# Altium schematic sheet MULTIB.SchDoc
size A3
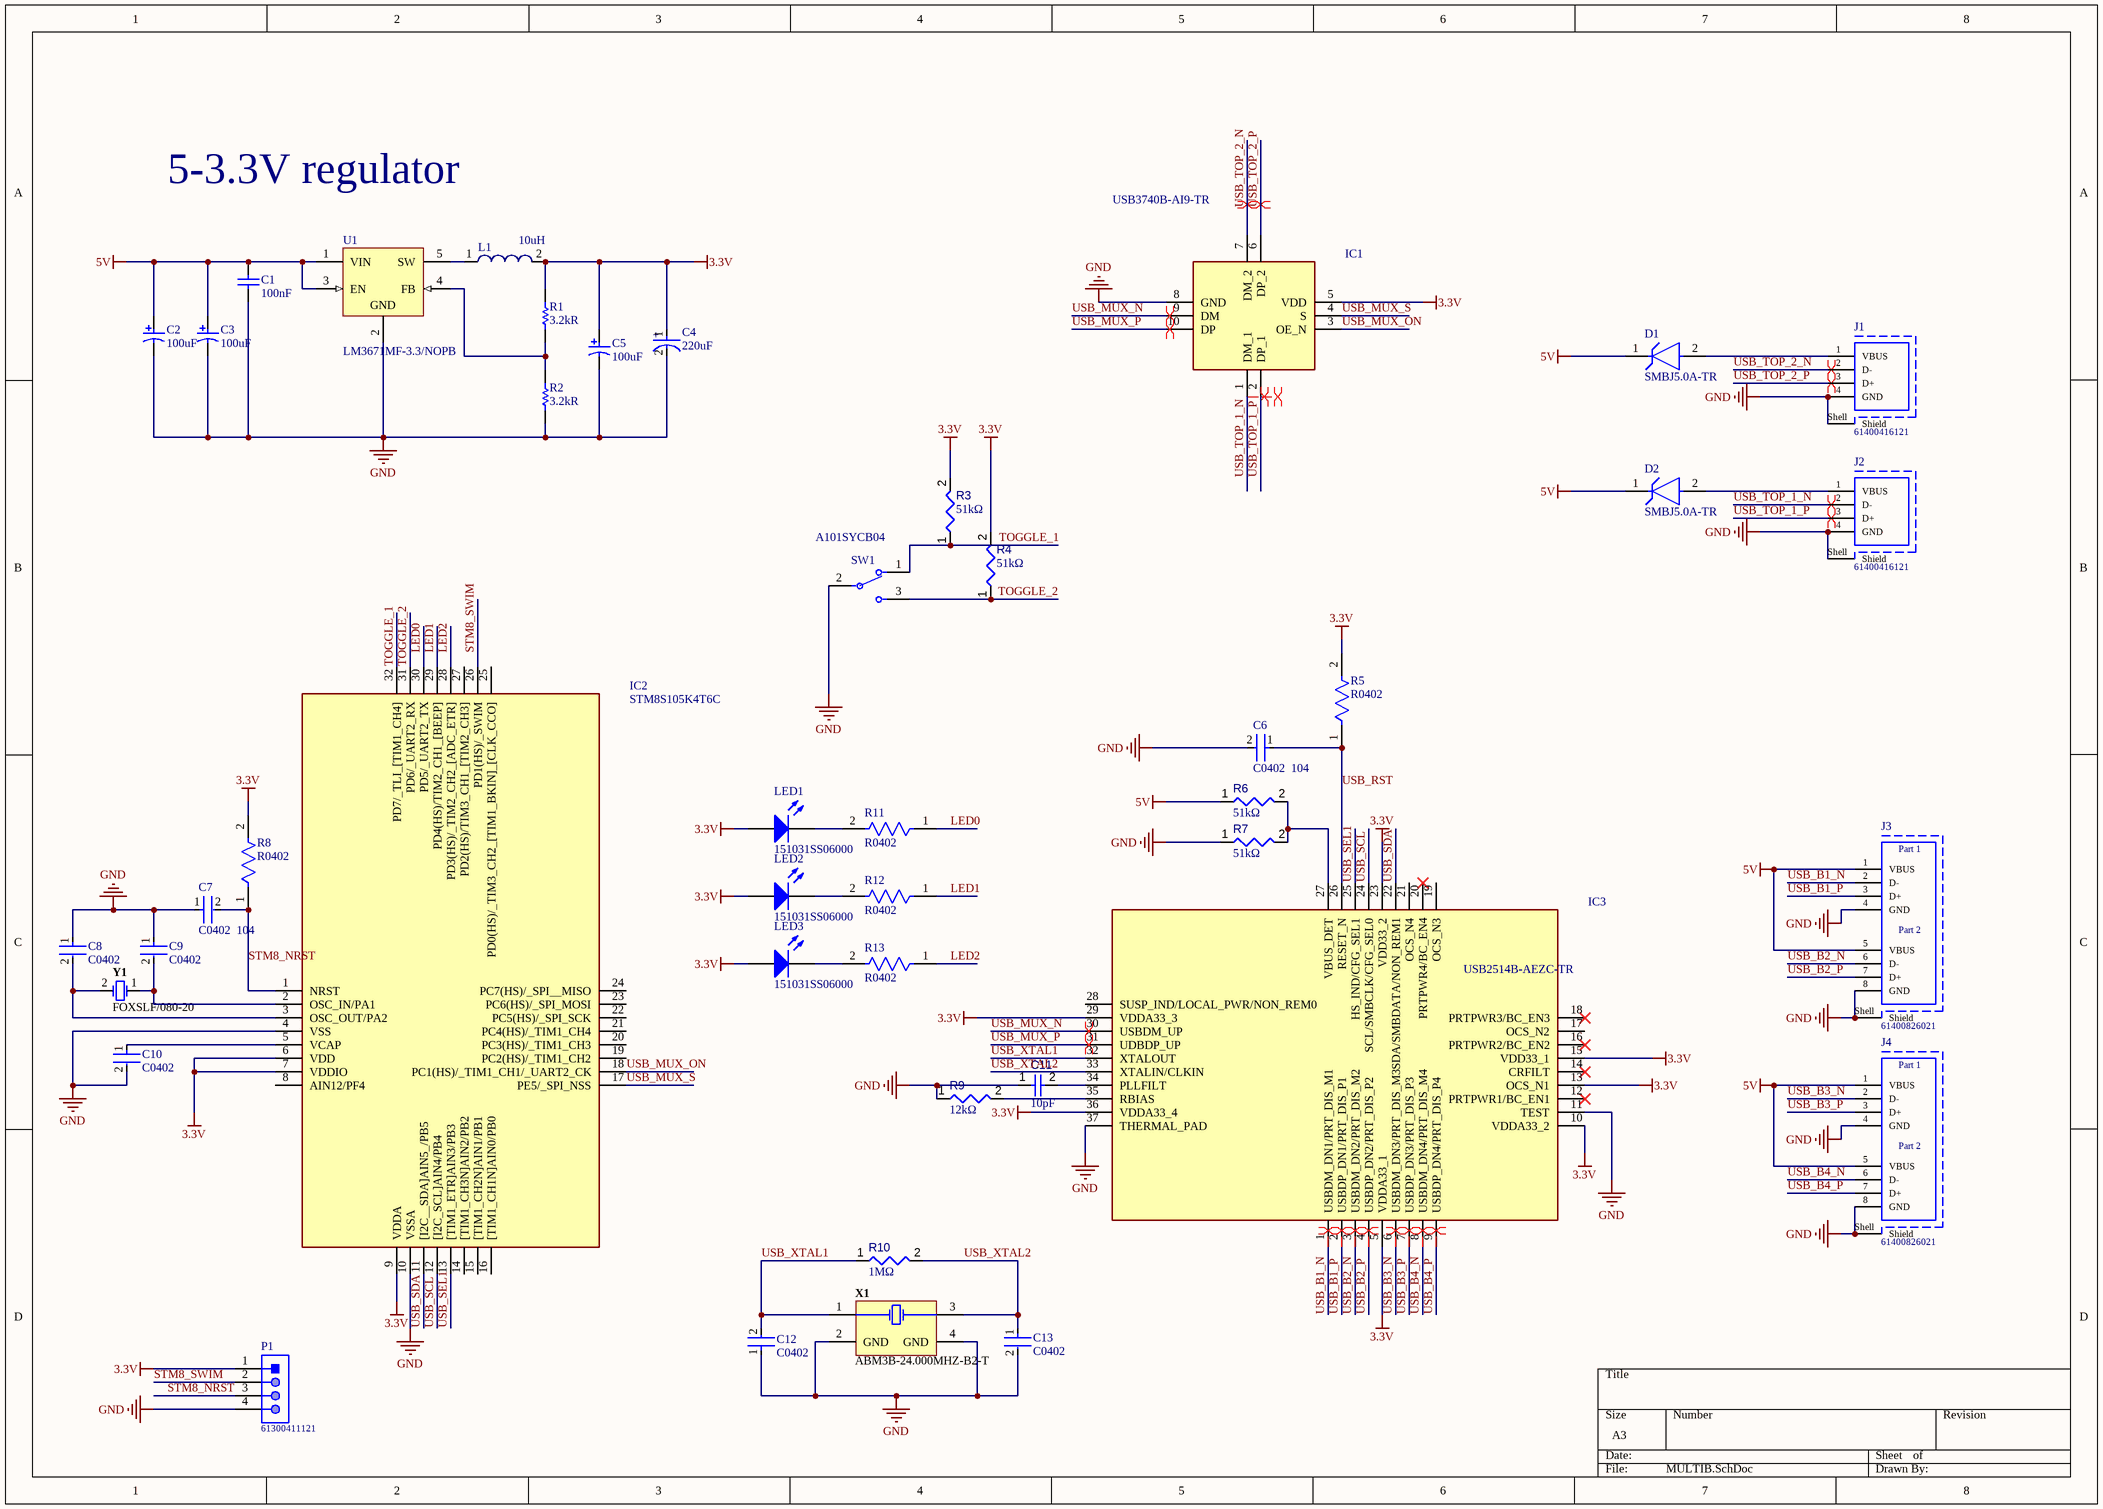
[diagram p0: MULTIB.SchDoc]

## Parts
C1  100nF  [CAPC1608X90X35ML10T15]
C2  100uF  [CAPPR65-350-1150X800X1250]
C3  100uF  [CAPPR65-350-1150X800X1250]
C4  220uF  [FP-EEU-FC1V221L-MFG]
C5  100uF  [CAPPR65-350-1150X800X1250]
C6  C0402  104  [FP-C0402-BB-MFG]
C7  C0402  104  [FP-C0402-BB-MFG]
C8  C0402  [FP-C0402-BB-MFG]
C9  C0402  [FP-C0402-BB-MFG]
C10  C0402  [FP-C0402-BB-MFG]
C11  value 10pF  [CAPC1608X90X40ML10T20]  (hidden comment: Capacitor 10 pF +/- 5% 50 V 0603)
C12  C0402  [FP-C0402-BB-MFG]
C13  C0402  [FP-C0402-BB-MFG]
D1  SMBJ5.0A-TR  [FP-SMB-MFG]
D2  SMBJ5.0A-TR  [FP-SMB-MFG]
IC1  USB3740B-AI9-TR  [USB3740BAI9TR]
IC2  STM8S105K4T6C  [QFP80P900X900X160-32N]
IC3  USB2514B-AEZC-TR  [QFN50P600X600X100-37N-D]
J1  61400416121  [61400416121]
J2  61400416121  [61400416121]
J3  61400826021  [61400826021]
J4  61400826021  [61400826021]
L1  10uH  [WE-SPC 4838]
LED1  151031SS06000  [Type 3mm]
LED2  151031SS06000  [Type 3mm]
LED3  151031SS06000  [Type 3mm]
P1  61300411121  [61300411121]
R1  3.2kR  [RESC1005X40X25LL05T05]
R2  3.2kR  [RESC1005X40X25LL05T05]
R3  value 51kΩ  [RESC0603(1608)_L]  (hidden comment: 120R3J)
R4  value 51kΩ  [RESC0603(1608)_L]  (hidden comment: 120R3J)
R5  R0402  [FP-CRCW0402-e3-IPC_C]
R6  value 51kΩ  [RESC0603(1608)_L]  (hidden comment: 120R3J)
R7  value 51kΩ  [RESC0603(1608)_L]  (hidden comment: 120R3J)
R8  R0402  [FP-CRCW0402-e3-IPC_C]
R9  value 12kΩ  [RESC0603(1608)_L]  (hidden comment: 120R3J)
R10  value 1MΩ  [RESC0603(1608)_L]  (hidden comment: 120R3J)
R11  R0402  [FP-CRCW0402-e3-IPC_C]
R12  R0402  [FP-CRCW0402-e3-IPC_C]
R13  R0402  [FP-CRCW0402-e3-IPC_C]
SW1  A101SYCB04  [FP-A101SYCB04-MFG]
U1  LM3671MF-3.3/NOPB  [DBV0005A_N]
X1  ABM3B-24.000MHZ-B2-T  [ABRA-ABM3B-4_V]
Y1  FOXSLF/080-20  [FOX-FOXSLF080-20]

## Nets
3.3V: C4.1(C) C5.1 IC1.5(VDD) IC2.6(VDD) IC2.7(VDDIO) IC2.9(VDDA) IC3.5(VDDA33_1) IC3.10(VDDA33_2) IC3.13(OCS_N1) IC3.15(VDD33_1) IC3.23(VDD33_2) IC3.29(VDDA33_3) IC3.36(VDDA33_4) L1.2 LED1.2(A) LED2.2(A) LED3.2(A) P1.1 R1.2 R3.2 R4.2 R5.2 R8.2
5V: C1.2 C2.1 C3.1 D1.1(K) D2.1(K) J3.1(VBUS) J3.5(VBUS) J4.1(VBUS) J4.5(VBUS) R6.1 U1.1(VIN) U1.3(EN)
GND: C1.1 C2.2 C3.2 C4.2(A) C5.2 C6.2 C7.1 C8.1 C9.1 C10.2 C11.1 C12.1 C13.2 IC1.8(GND) IC2.4(VSS) IC2.10(VSSA) IC3.11(TEST) IC3.37(THERMAL_PAD) J1.4(GND) J1.Shell(Shield) J2.4(GND) J2.Shell(Shield) J3.4(GND) J3.8(GND) J3.Shell(Shield) J4.4(GND) J4.8(GND) J4.Shell(Shield) P1.4 R2.1 R7.1 R9.1 SW1.2 U1.2(GND) X1.2(GND) X1.4(GND)
LED0: IC2.30(PD5/_UART2_TX) R11.1
LED1: IC2.29(PD4(HS)/TIM2_CH1_[BEEP]) R12.1
LED2: IC2.28(PD3(HS)/_TIM2_CH2_[ADC_ETR]) R13.1
STM8_NRST: C7.2 IC2.1(NRST) P1.3 R8.1
STM8_SWIM: IC2.26(PD1(HS)/_SWIM) P1.2
TOGGLE_1: IC2.32(PD7/_TLI_[TIM1_CH4]) R3.1 SW1.1
TOGGLE_2: IC2.31(PD6/_UART2_RX) R4.1 SW1.3
USB_B1_N: IC3.1(USBDM_DN1/PRT_DIS_M1) J3.2(D-)
USB_B1_P: IC3.2(USBDP_DN1/PRT_DIS_P1) J3.3(D+)
USB_B2_N: IC3.3(USBDM_DN2/PRT_DIS_M2) J3.6(D-)
USB_B2_P: IC3.4(USBDP_DN2/PRT_DIS_P2) J3.7(D+)
USB_B3_N: IC3.6(USBDM_DN3/PRT_DIS_M3) J4.2(D-)
USB_B3_P: IC3.7(USBDP_DN3/PRT_DIS_P3) J4.3(D+)
USB_B4_N: IC3.8(USBDM_DN4/PRT_DIS_M4) J4.6(D-)
USB_B4_P: IC3.9(USBDP_DN4/PRT_DIS_P4) J4.7(D+)
USB_MUX_N: IC1.9(DM) IC3.30(USBDM_UP)
USB_MUX_ON: IC1.3(OE_N) IC2.18(PC1(HS)/_TIM1_CH1/_UART2_CK)
USB_MUX_P: IC1.10(DP) IC3.31(UDBDP_UP)
USB_MUX_S: IC1.4(S) IC2.17(PE5/_SPI_NSS)
USB_RST: C6.1 IC3.26(RESET_N) R5.1
USB_SCL: IC2.12([I2C_SCL]AIN4/PB4) IC3.24(SCL/SMBCLK/CFG_SEL0)
USB_SDA: IC2.11([I2C__SDA]AIN5_/PB5) IC3.22(SDA/SMBDATA/NON_REM1)
USB_SEL1: IC2.13([TIM1_ETR]AIN3/PB3) IC3.25(HS_IND/CFG_SEL1)
USB_TOP_1_N: IC1.1(DM_1) J2.2(D-)
USB_TOP_1_P: IC1.2(DP_1) J2.3(D+)
USB_TOP_2_N: IC1.7(DM_2) J1.2(D-)
USB_TOP_2_P: IC1.6(DP_2) J1.3(D+)
USB_XTAL1: C12.2 IC3.32(XTALOUT) R10.1 X1.1(X1)
USB_XTAL2: C13.1 IC3.33(XTALIN/CLKIN) R10.2 X1.3(X2)
NetC8_2: C8.2 IC2.3(OSC_OUT/PA2) Y1.2
NetC9_2: C9.2 IC2.2(OSC_IN/PA1) Y1.1
NetC10_1: C10.1 IC2.5(VCAP)
NetC11_2: C11.2 IC3.34(PLLFILT)
NetD1_2: D1.2(A) J1.1(VBUS)
NetD2_2: D2.2(A) J2.1(VBUS)
NetIC3_27: IC3.27(VBUS_DET) R6.2 R7.2
NetIC3_35: IC3.35(RBIAS) R9.2
NetL1_1: L1.1 U1.5(SW)
NetLED1_1: LED1.1(K) R11.2
NetLED2_1: LED2.1(K) R12.2
NetLED3_1: LED3.1(K) R13.2
NetR1_1: R1.1 R2.2 U1.4(FB)

Not connected (* = marked no-connect by the designer): IC2 8(AIN12/PF4) 14([TIM1_CH3N]AIN2/PB2) 15([TIM1_CH2N]AIN1/PB1) 16([TIM1_CH1N]AIN0/PB0) 19(PC2(HS)/_TIM1_CH2) 20(PC3(HS)/_TIM1_CH3) 21(PC4(HS)/_TIM1_CH4) 22(PC5(HS)/_SPI_SCK) 23(PC6(HS)/_SPI_MOSI) 24(PC7(HS)/_SPI__MISO) 25(PD0(HS)/_TIM3_CH2_[TIM1_BKIN]_[CLK_CCO]) 27(PD2(HS)/TIM3_CH1_[TIM2_CH3]); IC3 12(PRTPWR1/BC_EN1)* 14(CRFILT)* 16(PRTPWR2/BC_EN2)* 17(OCS_N2) 18(PRTPWR3/BC_EN3)* 19(OCS_N3) 20(PRTPWR4/BC_EN4)* 21(OCS_N4) 28(SUSP_IND/LOCAL_PWR/NON_REM0)

## Layout directives
differential pair: USB_B1_N, USB_B1_P, USB_B2_N, USB_B2_P, USB_B3_N, USB_B3_P, USB_B4_N, USB_B4_P, USB_MUX_N, USB_MUX_P, USB_TOP_1_N, USB_TOP_1_P, USB_TOP_2_N, USB_TOP_2_P

## Notes on the sheet
- 5-3.3V regulator
- (in symbol CMP-1502-03229-1) Part 1; Part 2
- (in symbol CMP-05427-000010-1) +

## Library data of the parts
C1 = CMP-2000-04945-1: Chip Capacitor, 22 pF, +/- 5%, 50 V, -55 to 125 degC, 0603 (1608 Metric), RoHS, Tape and Reel; Manufacturer: Murata; Capacitance: 22pF; Rated Voltage: 50V; Dielectric: C0G; Manufacturer URL: http://www.murata.com/; Datasheet Version: Jul-06; Package Reference: 603; Tolerance (%): ±5%; Case Size/Dimension: 0603; Package Description: 2-Pin Surface Mount Device, Body 1.6 x 0.8 mm; Datasheet URL: https://datasheet.ciiva.com/11786/0900766b807a1cab-11786398.pdf
C2 C3 C5 = CMP-1665-00042-2: Aluminum Electrolytic Capacitor, 100 uF, +/- 20%, 50 V, -40 to 85 degC, 2-Pin THD, RoHS, Bulk; Manufacturer: Panasonic; Lead Diameter: 0.6mm; Dielectric Material: Aluminium; Voltage Rating (DC): 50V; Ripple Current (AC): 250mA; Polarity: Polar; Leakage Current: 3uA; Life (Hours): 2000Hour; Lead/Base Style: Straight; Dissipation Factor: 0.12%; Radiation Hardening: No; Height: 11.5mm; Package Quantity: 200; Package Reference: CAPPR65-350-1150X800X1250; Min Operating Temperature: -40degC; Mount: ThroughHole; Package Description: 2-Pin Radial Lead, Dia 8 mm, Height 12.5 mm; Case/Package: Radial; Diameter: 8mm; Voltage Rating: 50V; Length: 11.5mm; REACH SVHC: NoSVHC; Height - Seated (Max): 0.492inch; Datasheet URL: https://industrial.panasonic.com/cdbs/www-data/pdf/RDF0000/ABA0000C1218.pdf; RoHSCompliant: true; Ripple Current: 250mA; Lead Free: LeadFree; Voltage: 50V; Manufacturer URL: http://www.panasonic.com/; Number of Pins: 2; Datasheet Version: Rev. 05, 10/2016; Packaging: Bulk; Termination: Radial; Max Operating Temperature: 85degC; Tolerance: 20%; Capacitance: 100uF; Lead Pitch: 3.5mm
C4 = CMP-05427-000010-1: CAP ALUM 220UF 20% 35V RADIAL; Manufacturer: Panasonic Electronic Components; Manufacturer Part Number: EEU-FC1V221L; Material: Aluminum; Leakage Current: 77uA; Esr: 0.085Ω; Life: 2000Hours; Automotive Grade: Grade 2; Dissipation Factor: 12%; Ripple Current: 730mA; Octopart: https://octopart.com/eeu-fc1v221l-panasonic-39478519; ComponentLink2URL: https://industrial.panasonic.com/cdbs/www-data/pdf/RDF0000/ABA0000C1209.pdf; Package: 0; Height: 16.5mm; Category: Cap; Value: 220uF; ComponentLink2Description: Datasheet; Lead Free: Yes; Device Class L2: Capacitors; Temperature Range High: +105°C; Mouser Description: Capacitor; Aluminum Electrolytic; Fc Radial Elec Cap 220uF 35V; Temperature: -55°C to +105°C; Digikey Description: CAP ALUM 220UF 20% 35V RADIAL; Device Class L3: Aluminum Electrolytic Capacitors; Device Class L1: Passive Components; Automotive: Yes; RoHS: TRUE; Temperature Range Low: -55°C; Capacitance: 220uF; Voltage Rating: 35V; Tolerance: 20%
C6-C10 C12 C13 = CMP-2008-02046-2: CAP CER 0.1UF 10V X5R 0402; Manufacturer: Kemet; Manufacturer Part Number: C0402C104K8PACTU; Material: Ceramic; Capacitance: 0.10 μF; Temperature Coefficient: 15%; Tolerance: 0.1; Value: 0.10 μF; Package: C0402-BB; Temperature: -55°C to +125°C; ComponentLink2Description: Datasheet; Temperature Characteristic: X5R; Device Class L1: Passive Components; Height: 0.55mm; Lead Free: Yes; ComponentLink2URL: https://content.kemet.com/datasheets/KEM_C1002_X7R_SMD.pdf; Device Class L2: Capacitors; Temperature Range Low: -55°C; Temperature Range High: +125°C; RoHS: TRUE; Octopart: https://octopart.com/c0402c104k8pactu-kemet-140039; Automotive: No; Mouser Description: Capacitor 100 nF 10 VDC 0402; Category: Cap; Voltage Rating: 10 V; Digikey Description: CAP CER 0.1UF 10V X5R 0402; Ipc Land Pattern Name: CAPC10050X50; Device Class L3: Ceramic Capacitors
C11 = CMP-001-00014-4: Chip Capacitor, 10 pF, +/- 5%, 50 V, 0603 (1608 Metric); Voltage Rating: 50V; Capacitor Type: Ceramic; RoHS Compliant: True; Max Operating Temperature: 125°C; Pins: 2; Tolerance: 5%; Case/Package: 0603; Mounting Technology: SM; Min Operating Temperature: -55°C
D1 D2 = CMP-12225-000019-1: TVS DIODE 5V 13.4V SMB; Manufacturer: STMicroelectronics; Number Of Channels: 1; Peak Pulse Power: 600W; Clamping Voltage: 14.4V; Standoff Height: 0.05mm; Peak Pulse Current: 275A; Max Junction Temp: +150°C; Direction: Unidirectional; Breakdown Voltage: 6.4V; Device Class L3: unset; Mouser Description: SMBJ Series 600 W 5 V Uni Directional SMT TVS Diode - DO-214AA; Automotive: No; Lead Free: Yes; ComponentLink2URL: https://www.st.com/resource/en/datasheet/smbj.pdf; Package: SMB; Reverse Standoff Voltage: 5V; Device Class L1: Circuit Protection; RoHS: TRUE; Temperature Range Low: -55°C; Category: Diode; Manufacturer Part Number: SMBJ5.0A-TR; Digikey Description: TVS DIODE 5V 13.4V SMB; Height: 2.65mm; Temperature Range High: +150°C; Octopart: https://octopart.com/smbj5.0a-tr-stmicroelectronics-347079; Device Class L2: TVS Diodes; ComponentLink2Description: Datasheet; Temperature: -55°C to +150°C
IC1 = USB3740B-AI9-TR: Integrated Circuit; Manufacturer_Name: Microchip; Datasheet Link: http://www.microchip.com/mymicrochip/filehandler.aspx?ddocname=en562428; Height: 0.6mm; Manufacturer_Part_Number: USB3740B-AI9-TR; Mouser Part Number: 886-USB3740B-AI9-TR; Mouser Price/Stock: https://www.mouser.co.uk/ProductDetail/Microchip-Technology/USB3740B-AI9-TR/?qs=pA5MXup5wxFFkk8V1NniAg%3D%3D; Arrow Part Number: USB3740B-AI9-TR; Arrow Price/Stock: https://www.arrow.com/en/products/usb3740b-ai9-tr/microchip-technology
IC2 = STM8S105K4T6C: Integrated Circuit; Manufacturer_Name: STMicroelectronics; Datasheet Link: http://www.st.com/st-web-ui/static/active/en/resource/technical/document/datasheet/CD00200092.pdf; Height: 1.6mm; Manufacturer_Part_Number: STM8S105K4T6C; Mouser Part Number: 511-STM8S105K4T6C; Mouser Price/Stock: https://www.mouser.co.uk/ProductDetail/STMicroelectronics/STM8S105K4T6C?qs=YSp3DhtTcU05QnjDVzmM7w%3D%3D; Arrow Part Number: STM8S105K4T6C; Arrow Price/Stock: https://www.arrow.com/en/products/stm8s105k4t6c/stmicroelectronics
IC3 = USB2514B-AEZC-TR: Integrated Circuit; Manufacturer_Name: Microchip; Datasheet Link: http://ww1.microchip.com/downloads/en/DeviceDoc/00001692C.pdf; Height: 1mm; Manufacturer_Part_Number: USB2514B-AEZC-TR; Mouser Part Number: 886-USB2514B-AEZC-TR; Mouser Price/Stock: https://www.mouser.co.uk/ProductDetail/Microchip-Technology/USB2514B-AEZC-TR?qs=pA5MXup5wxH7Kbx1p0cM6A%3D%3D; Arrow Part Number: USB2514B-AEZC-TR; Arrow Price/Stock: https://www.arrow.com/en/products/usb2514b-aezc-tr/microchip-technology
J1 J2 = CMP-1502-03243-1: USB 2.0 Type B Receptacle WR-COM, Horizontal, THT, with Pads and Pegs; Manufacturer: Wurth Elektronik; Contact Resistance: 20mOhm; Rated Current: 1.5A; Working Voltage: 30VAC; Package Reference: 61400416121; Part Number: 61400416121; Packaging: Tray; Mounting Technology: THT; Gender: Receptacle; Datasheet URL: https://katalog.we-online.de/em/datasheet/61400416121.pdf; Publisher: WurthElektronik; Orientation: Horizontal; Connector Type: USB2.0TypeB; Operating Temperature: -40to105degC; Manufacturer URL: http://www.we-online.de
J3 J4 = CMP-1502-03229-1: USB 2.0 Type A Receptacle WR-COM, Stacked Horizontal, THT; Manufacturer: Wurth Elektronik; Contact Resistance: 20mOhm; Rated Current: 1.5A; Working Voltage: 30VAC; Connector Type: USB2.0TypeA; Packaging: Tray; Package Reference: 61400826021; Mounting Technology: THT; Datasheet URL: https://katalog.we-online.de/em/datasheet/61400826021.pdf; Operating Temperature: -40to105degC; Gender: Receptacle; Orientation: StackedHorizontal; Part Number: 61400826021; Publisher: WurthElektronik; Manufacturer URL: http://www.we-online.de
L1 = CMP-1401-00032-1: SMD Shielded Power Inductor WE-SPC, L=10 µH; Manufacturer: Wuerth Elektronik; PartNumber: 74408943100; Inductance: 10 ÂµH; PackageReference: WE-SPC 4838; ComponentLink2Description: Datasheet; ComponentLink2URL: http://katalog.we-online.de/kataloge/eisos/media/pdf/74408943100.pdf; ComponentLink1URL: http://www.we-online.com; ComponentLink1Description: Manufacturer URL
LED1-LED3 = CMP-1488-00002-1: THT LED round mono-color color lens, WL-TMRW, Super Red; Manufacturer: Wuerth Elektronik; ComponentLink2URL: http://katalog.we-online.de/pbs/datasheet/7448042001.pdfhttp://katalog.we-online.de/pbs/datasheet/7448042001.pdfhttp://katalog.we-online.de/pbs/datasheet/7448042001.pdfhttp://katalog.we-online.de/pbs/datasheet/151031SS06000.pdf; ComponentLink1URL: http://www.we-online.com; PartNumber: 151031SS06000; ComponentLink2Description: Datasheet; PackageReference: Type 3mm; Emitting color: Super Red; ComponentLink1Description: Manufacturer URL
P1 = CMP-1502-01064-1: THT Vertical Pin Header WR-PHD, Pitch 2.54 mm, Single Row, 4 pins; Manufacturer: Wurth Elektronik; Withstanding Voltage: 500VAC; Rated Current: 3A; Working Voltage: 250VAC; Pin Number: 4; Gender: Male; Contact Resistance: 20mOhm; Pitch: 2.54mm; Manufacturer URL: http://www.we-online.de; Operating Temperature: -40to105degC; Packaging: Bag; Mounting Technology: THT; Package Reference: 61300411121; Datasheet URL: https://katalog.we-online.de/em/datasheet/6130xx11121.pdf; Publisher: WurthElektronik; Part Number: 61300411121; Row Number: Single; Orientation: Vertical
R1 R2 = CMP-2002-01154-4: Chip Resistor, 4.7 KOhm, +/- 1%, 0.1 W, -55 to 155 degC, 0402 (1005 Metric), RoHS, Tape and Reel; PartNumber: ERJ-2RKF4701X; Voltage Rating: 50 V; Case\/Package: 0402; Power Rating: 100 mW; Height: 0.35 mm; Mounting Technology: Surface Mount; REACH SVHC: Yes; Resistance: 4.7 KOhm; Max Operating Temperature: 155 degC; ComponentLink1Description: Manufacturer URL; ComponentLink2Description: Datasheet; Pins: 2; PackageReference: 0402; Tolerance: 1%; Case Code (Imperial): 0402; Length: 1 mm; PackageDescription: 2-Pin Surface Mount Device, Body 1 x 0.5 mm; RoHSCompliant: true; Package Quantity: 1; Radiation Hardening: No; DatasheetVersion: 04/2015; Width: 0.5 mm; Case Code (Metric): 1005; Mount: Surface Mount; ComponentLink1URL: http://www.panasonic.com/; Min Operating Temperature: -55 degC; Packaging: Cut Tape; ComponentLink2URL: http://industrial.panasonic.com/cdbs/www-data/pdf/RDA0000/AOA0000C86.pdf
R3 R4 R6 R7 R9 R10 = CMP-009-00069-1: 120R 0.1W 5% 0603 (1608 Metric)  SMD; Mounting Technology: SMT; Power: 0.1W; Tolerance: 5%; Case/Package: 0603; Pins: 2
R5 R8 R11-R13 = CMP-2002-08519-2: RES Thick Film, 32.4kΩ, 1%, 0.063W, 100ppm/°C, 0402; Voltage Rating: 50V; Max Power Dissipation: 63mW; Resistance: 32.4kR; Min Operating Temperature: -55°C; Width: 0.5mm; Number of Pins: 2; Contact Plating: Tin; Weight: 2.3E-05oz; Features: Automotive AEC-Q200; Case/Package: 0402; Case Code (Imperial): 0402; Number of Terminations: 2; Height: 0.35mm; Packaging: Tape and Reel; Radiation Hardening: No; Package Quantity: 10; Composition: Thick Film; Termination: SMD/SMT; Temperature Coefficient: 100ppm/°C; Length: 1mm; Depth: 0.5mm; Power Rating: 63mW; Tolerance: 1%; Max Operating Temperature: 155°C; Case Code (Metric): 1005; Military Standard: Not
SW1 = CMP-03408-000017-1: SWITCH TOGGLE SPDT 0.4VA 20V; Electrical Life: 6000Cycles; Number of Poles: 1; Power Rating: 400mW; Switch Function: On-On; Contact Resistance: 10mR; Contact Current Rating: 400mA; Actuator Material: Phenolic; Insulation Resistance: 30MR; Actuator Color: Chrome; Number of Positions: 2; Actuator Type: Standard Round; Actuator Length: 10.41mm; Illumination Type: Non-Illuminated; Flammability Rating: UL94 V-1; Contact Material: Copper; Depth: 6.86mm; Contact Plating: Gold; Voltage Rating (AC): 20V; Max Voltage Rating (DC): 20V; Min Operating Temperature: -30°C; Max Operating Temperature: 85°C; Throw Configuration: SPDT; Packaging: Bulk; Termination: PC Pins; Series: Gemini A; ELV: Compliant; Lead Free: Lead Free; RoHS Compliant: Yes; REACH SVHC: No SVHC; Mount: Panel; Orientation: Straight; Package Quantity: 100; Max Voltage Rating (AC): 20V; Radiation Hardening: No; Voltage Rating (DC): 20V
U1 = CMP-0063-01132-3: 2MHz, 600mA Step-Down DC-DC Converter, 5-pin SOT-23, Pb-Free; Manufacturer: Texas Instruments; CompType: MiscPower; PowerWise: Y; PackageTopMarking: SJEB*XTT; PackageDescription: Molded SOT-23, .115 x .063 x .040 in Body, 5 Lead, .0375 in Pitch; ComponentLink1Description: Datasheet URL; PackageReference: DBV0005A; PinCount: 5; RoHS: Y; ComponentLink1URL: http://www.ti.com/general/docs/lit/getliterature.tsp?genericPartNumber=LM3671&fileType=pdf
X1 = CMP-1688-00008-1: Ceramic SMD Crystal, 24 MHz, +/- 20 ppm, 50 Ohm, -20 to 70 degC, 4-Pin SMD, RoHS, Tape and Reel; Impedance: 50 Ohm; Mating Cycles: 30; Frequency: 6 Hz; Contact Material: Brass; Contact Plating: Gold; PackageReference: ABM3B; Min Operating Temperature: -40 degC; ComponentLink2Description: Datasheet; Radiation Hardening: No; DatasheetVersion: Aug-15; Packaging: Tape and Reel; Length: 2.6 mm; Package Quantity: 2500; REACH SVHC: Unknown; PackageDescription: 4-Pin Surface Mount Device, Body 5 x 3.2 mm; Weight: 0.001058 oz; ComponentLink2URL: http://www.abracon.com/Resonators/abm3b.pdf; ComponentLink1Description: Manufacturer URL; Width: 3 mm; RoHSCompliant: true; Fastening Type: Snap; Max Operating Temperature: 155 degC; ComponentLink1URL: http://www.abracon.com/; Height: 1.244 mm; Mount: Surface Mount
Y1 = CMP-1749-00002-1: Resistance Weld Thru-Hole Crystal, 8 MHz, -20 to 70 degC, 2-Pin THD, RoHS, Bulk; Dropout Voltage: 2 V; Outputs: 1; Nominal Output Voltage: 5 V; Min Input Voltage: 7 V; Case\Package: TO-263-3; Max Input Voltage: 35 V; Max Ouput Current: 1 A; Length: 10.24 mm; Max Operating Temperature: 125 degC; Mount: Surface Mount; PackageDescription: 2-Pin Through Hole Device, Body 11.35 x 4.65 mm; Package Quantity: 50; Pins: 3; ComponentLink2URL: http://download.siliconexpert.com/pdfs/2015/4/5/6/5/7/200/fox_/manual/35607121449963728hc49slf.pdf; PackageReference: FOXSLF080-20; Min Operating Temperature: 0 degC; Height: 30.02 mm; Packaging: Rail/Tube; Radiation Hardening: No; Width: 9.35 mm; ComponentLink1URL: http://www.foxonline.com/; DatasheetVersion: Mar-15; ComponentLink1Description: Manufacturer URL; Output Voltage: 5 V; RoHSCompliant: true; REACH SVHC: No SVHC; Output Current: 1 A; ComponentLink2Description: Datasheet